# Altium project STM32 MCU.PrjPcb
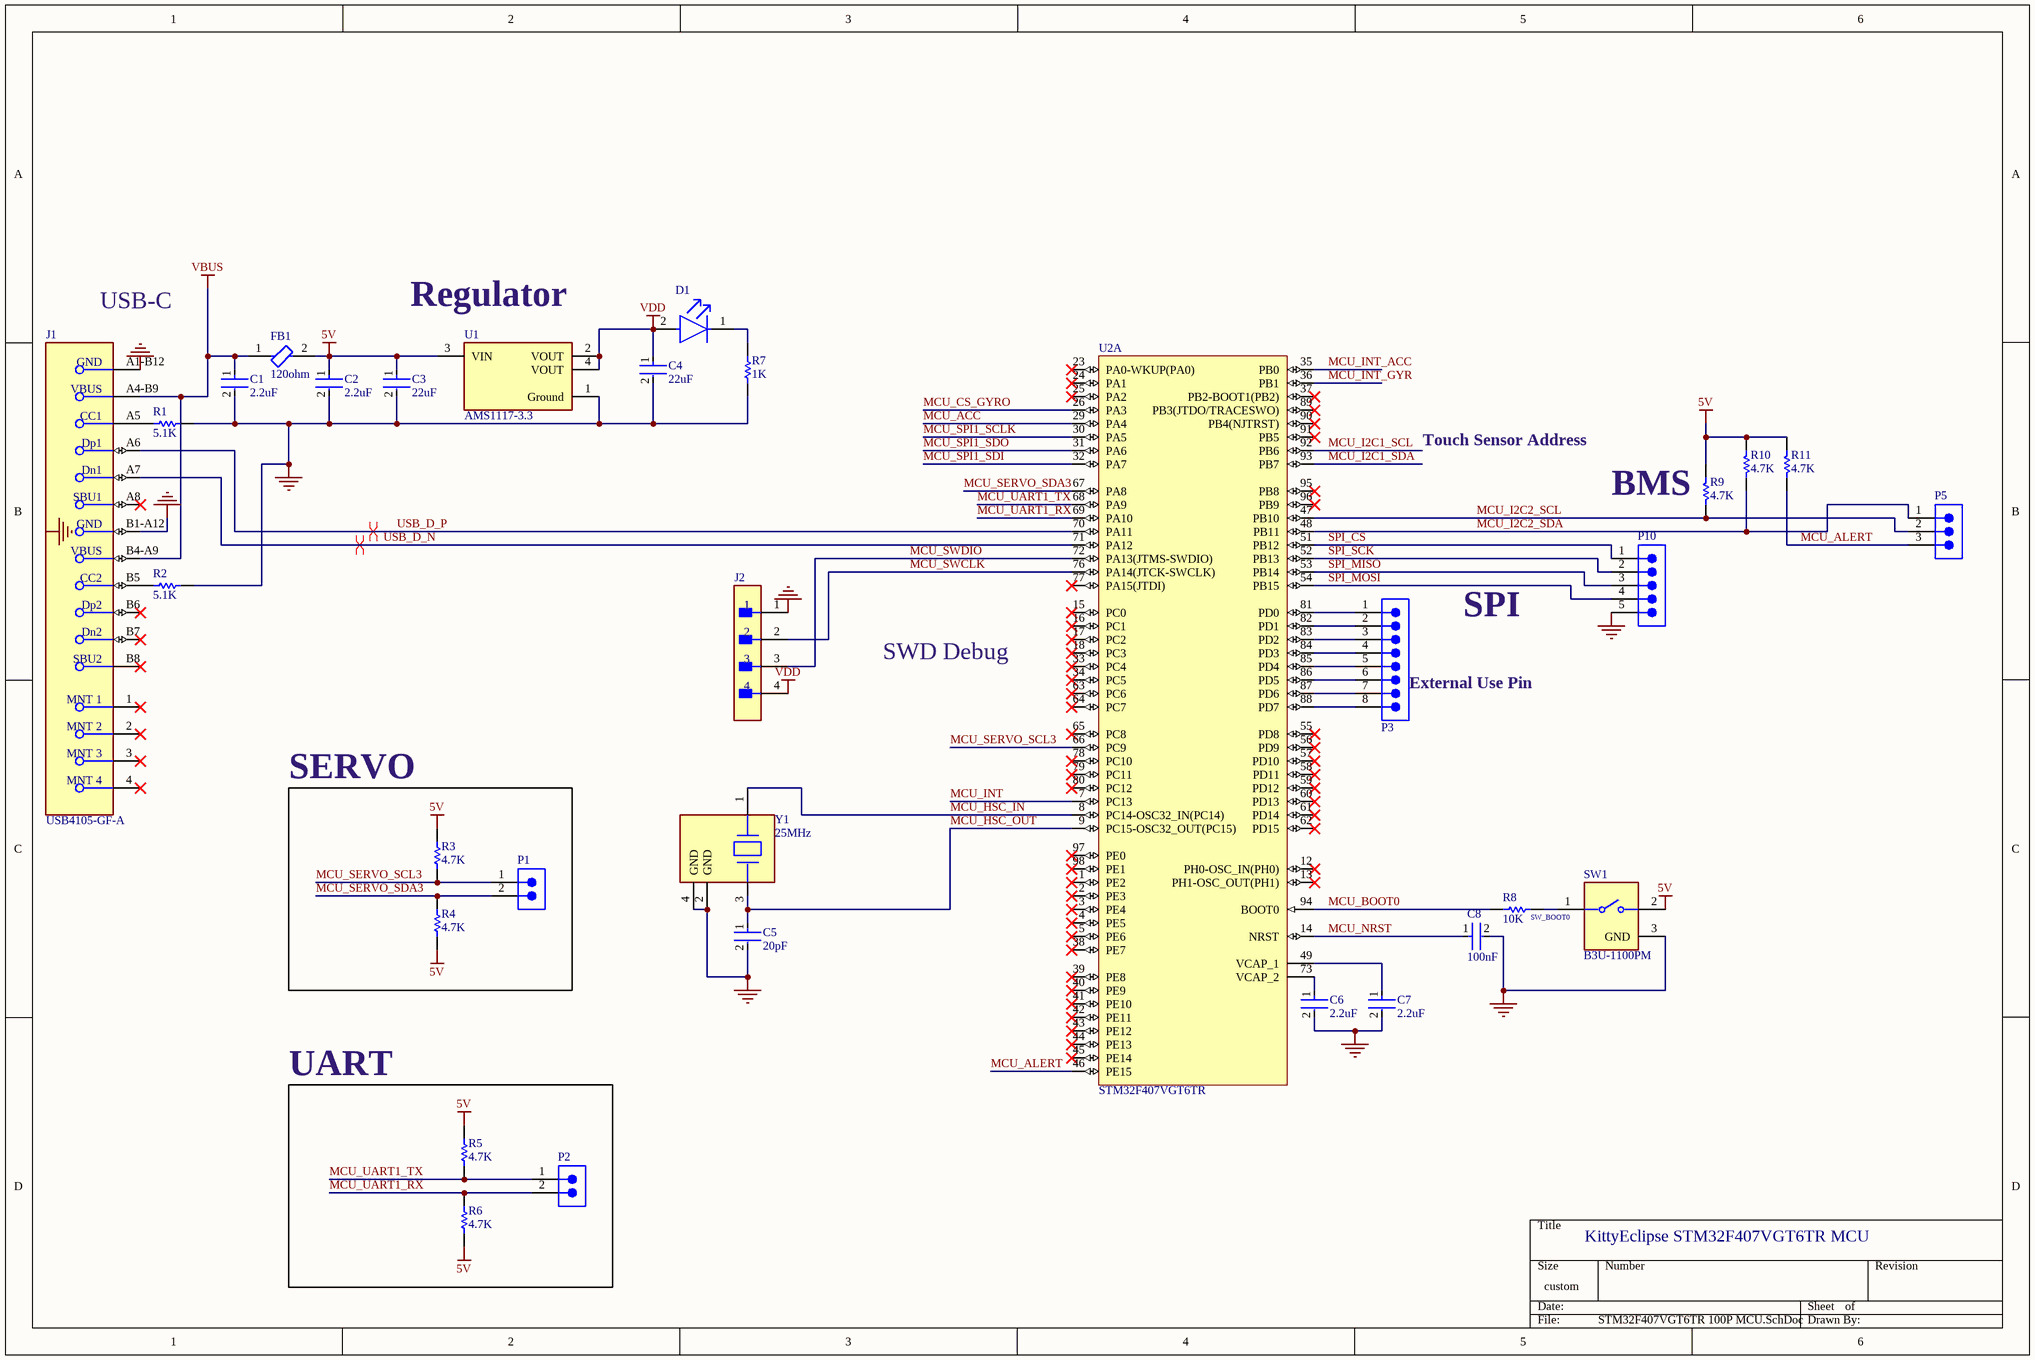
[diagram p0: STM32F407VGT6TR 100P MCU.SchDoc]
2 sheets, 52 parts. Net scope: global (net labels, ports and power ports of the same name join across sheets).
Board file: MCU.PcbDoc
Sheets:
  STM32F407VGT6TR 100P MCU.SchDoc
  Power.SchDoc

## Sheet STM32F407VGT6TR 100P MCU.SchDoc
size 381 x 254 mm

### Parts
C1  2.2uF  [FP-CL10-IPC_A]
C2  2.2uF  [FP-CL10-IPC_A]
C3  22uF  [FP-CL21-IPC_A]
C4  22uF  [FP-CL21-IPC_A]
C5  20pF  [FP-GCM155-0_05-IPC_A]
C6  2.2uF  [FP-CL10-IPC_A]
C7  2.2uF  [FP-CL10-IPC_A]
C8  100nF  [FP-CL93-IPC_C]
D1  LTST-C190GKT  [FP-LTST-C190GKT-MFG]  (value not drawn)
FB1  120ohm  [FP-MPZ1608-0_8-IPC_C]
J1  USB4105-GF-A  [FP-USB4105-GF-A-MFG]
J2  B4B-ZR(LF)(SN)  [FP-B4B-ZR_LF_SN-MFG]  (value not drawn)
P1  61300211121  [61300211121]  (value not drawn)
P2  61300211121  [61300211121]  (value not drawn)
P3  61300811121  [61300811121]  (value not drawn)
P5  61300311121  [61300311121]  (value not drawn)
P10  61300511121  [61300511121]  (value not drawn)
R1  5.1K  [RESC1005X40X25NL10T10]
R2  5.1K  [RESC1005X40X25NL10T10]
R3  4.7K  [RESC1608X55X25LL10T15]
R4  4.7K  [RESC1608X55X25LL10T15]
R5  4.7K  [RESC1608X55X25LL10T15]
R6  4.7K  [RESC1608X55X25LL10T15]
R7  1K  [RESC1608X55X30LL15T15]
R8  10K  [RESC1608X55X25ML10T15]
R9  4.7K  [RESC1608X55X25LL10T15]
R10  4.7K  [RESC1608X55X25LL10T15]
R11  4.7K  [RESC1608X55X25LL10T15]
SW1  B3U-1100PM  [FP-B3U-1100PM-MFG]
U1  AMS1117-3.3  [FP-AMS1117-IPC_C]
U2  STM32F407VGT6TR  [STM-LQFP100_L]  (part A of 2)
Y1  25MHz  [FP-ABM11W-MFG]

### Blocks framed on the sheet
SERVO: P1 R3 R4
UART: P2 R5 R6

### Nets
5V: C2.1 C3.1 FB1.2 R3.2 R4.1 R5.1 R6.1 R9.1 R10.1 R11.1 SW1.2 U1.3(VIN)
GND: C1.2 C2.2 C3.2 C4.2 C5.2 C6.2 C7.2 C8.2 J1.A1-B12(GND) J1.B1-A12(GND) J2.1 P10.5 R1.2 R2.2 R7.2 SW1.3(GND) U1.1(Ground) Y1.2(GND) Y1.4(GND)
VBUS: C1.1 FB1.1 J1.A4-B9(VBUS) J1.B4-A9(VBUS)
VDD: C4.1 D1.2(A) J2.4 U1.2(VOUT) U1.4(VOUT)
MCU_ACC: U2.29(PA4)
MCU_ALERT: P5.3 R11.2 U2.46(PE15)
MCU_BOOT0: R8.1 U2.94(BOOT0)
MCU_CS_GYRO: U2.26(PA3)
MCU_HSC_IN: U2.8(PC14-OSC32_IN(PC14)) Y1.1
MCU_HSC_OUT: C5.1 U2.9(PC15-OSC32_OUT(PC15)) Y1.3
MCU_I2C1_SCL: U2.92(PB6)
MCU_I2C1_SDA: U2.93(PB7)
MCU_I2C2_SCL: P5.2 R9.2 U2.47(PB10)
MCU_I2C2_SDA: P5.1 R10.2 U2.48(PB11)
MCU_INT: U2.7(PC13)
MCU_INT_ACC: U2.35(PB0)
MCU_INT_GYR: U2.36(PB1)
MCU_NRST: C8.1 U2.14(NRST)
MCU_SERVO_SCL3: P1.1 R3.1 U2.66(PC9)
MCU_SERVO_SDA3: P1.2 R4.2 U2.67(PA8)
MCU_SPI1_SCLK: U2.30(PA5)
MCU_SPI1_SDI: U2.32(PA7)
MCU_SPI1_SDO: U2.31(PA6)
MCU_SWCLK: J2.2 U2.76(PA14(JTCK-SWCLK))
MCU_SWDIO: J2.3 U2.72(PA13(JTMS-SWDIO))
MCU_UART1_RX: P2.2 R6.2 U2.69(PA10)
MCU_UART1_TX: P2.1 R5.2 U2.68(PA9)
SPI_CS: P10.1 U2.51(PB12)
SPI_MISO: P10.3 U2.53(PB14)
SPI_MOSI: P10.4 U2.54(PB15)
SPI_SCK: P10.2 U2.52(PB13)
USB_D_N: J1.A7(Dn1) U2.71(PA12)
USB_D_P: J1.A6(Dp1) U2.70(PA11)
NetC6_1: C6.1 U2.73(VCAP_2)
NetC7_1: C7.1 U2.49(VCAP_1)
NetD1_1: D1.1(C) R7.1
NetJ1_A5: J1.A5(CC1) R1.1
NetJ1_B5: J1.B5(CC2) R2.1
NetP3_1: P3.1 U2.81(PD0)
NetP3_2: P3.2 U2.82(PD1)
NetP3_3: P3.3 U2.83(PD2)
NetP3_4: P3.4 U2.84(PD3)
NetP3_5: P3.5 U2.85(PD4)
NetP3_6: P3.6 U2.86(PD5)
NetP3_7: P3.7 U2.87(PD6)
NetP3_8: P3.8 U2.88(PD7)
NetR8_2: R8.2 SW1.1

Not connected (* = marked no-connect by the designer): J1 1(MNT_1)* 2(MNT_2)* 3(MNT_3)* 4(MNT_4)* A8(SBU1)* B6(Dp2)* B7(Dn2)* B8(SBU2)*; U2 1(PE2)* 2(PE3)* 3(PE4)* 4(PE5)* 5(PE6)* 12(PH0-OSC_IN(PH0))* 13(PH1-OSC_OUT(PH1))* 15(PC0)* 16(PC1)* 17(PC2)* 18(PC3)* 23(PA0-WKUP(PA0))* 24(PA1)* 25(PA2)* 33(PC4)* 34(PC5)* 37(PB2-BOOT1(PB2))* 38(PE7)* 39(PE8)* 40(PE9)* 41(PE10)* 42(PE11)* 43(PE12)* 44(PE13)* 45(PE14)* 55(PD8)* 56(PD9)* 57(PD10)* 58(PD11)* 59(PD12)* 60(PD13)* 61(PD14)* 62(PD15)* 63(PC6)* 64(PC7)* 65(PC8)* 77(PA15(JTDI))* 78(PC10)* 79(PC11)* 80(PC12)* 89(PB3(JTDO/TRACESWO))* 90(PB4(NJTRST))* 91(PB5)* 95(PB8)* 96(PB9)* 97(PE0)* 98(PE1)*

### Layout directives
differential pair: USB_D_N, USB_D_P

### Notes on the sheet
- USB-C
- (near U1) Regulator
- Touch Sensor Address
- BMS
- SPI
- SWD Debug
- (near P3) External Use Pin
- (near R8) SW_BOOT0
- KittyEclipse STM32F407VGT6TR MCU
- Labels drawn without touching a wire or pin: GND

### Library data of the parts
C1 C2 C6 C7 = CMP-13271-000835-1: Cap Ceramic 2.2uF 16V X5R ±10% Pad SMD 0603 +85°C T/R; Case Code (Metric): 1608; Height: 0.8mm; Case/Package: 0603; Depth: 0.8mm; Capacitance: 2.2uF; Voltage Rating: 16V; Case Code (Imperial): 0603; Length: 1.6mm; Packaging: Tape and Reel; Material: Ceramic; Lead Free: Lead Free; Max Operating Temperature: 85°C; Contact Plating: Tin; Thickness: 0.035inch; Radiation Hardening: No; Tolerance: 10%; Min Operating Temperature: -55°C; Voltage: 16V; Dielectric: X5R; Mount: Surface Mount; Package Quantity: 4000; Width: 0.031inch; Voltage Rating (DC): 16V
C3 C4 = CMP-13271-000185-1: CL21 Series 0805 22uF 6.3V ±20% Tolerance X5R Multilayer Ceramic Chip Capacitor; Height: 1.25mm; Length: 2mm; Capacitance: 22uF; Mount: Surface Mount; Dielectric: X5R; Voltage Rating (DC): 6.3V; Case Code (Metric): 2012; Depth: 1.25mm; Max Operating Temperature: 85°C; Voltage Rating: 6.3V; Width: 0.049inch; Case/Package: 0805; Radiation Hardening: No; Thickness: 0.055inch; Packaging: Tape and Reel; Package Quantity: 2000; Lead Free: Lead Free; Contact Plating: Tin; Min Operating Temperature: -55°C; Case Code (Imperial): 0805; Tolerance: 20%
C5 = CMP-2008-03702-3: Ceramic Capacitor for Automotive 220pF ±5% 50VDC C0G 0402 Paper T/R; Temperature Coefficient: 30ppm/°C; Voltage Rating (DC): 50V; Thickness: 0.022inch; REACH SVHC: No SVHC; Termination: SMD/SMT; Radiation Hardening: No; Max Operating Temperature: 125°C; Mount: Surface Mount; Package Quantity: 1; Dielectric: C0G; Height: 0.5mm; Case Code (Imperial): 0402; Lead Free: Lead Free; Voltage Rating: 50V; Capacitance: 220pF; Case Code (Metric): 1005; Min Operating Temperature: -55°C; Case/Package: 0402; Packaging: Tape and Reel; Voltage: 50V; Ratings: AEC-Q200; Depth: 0.5mm; Length: 1mm; Tolerance: 5%; Width: 0.02inch
C8 = CMP-13271-000610-1: Cap Ceramic 100nF 10V X7R ±10% SMD 0402 +125°C Paper T/R
D1 = CMP-22017-000005-2: LED GREEN CLEAR CHIP SMD; Dominant Wavelength: 569nm; Reverse Voltage: 5V; Lens Color: Colorless; Viewing Angle: 130°; Voltage: 2V; Forward Current: 30mA; Power Dissipation: 100mW; Luminous Intensity: 6mcd; Number of LEDs: 1; Forward Voltage: 2.1V; Wavelength: 565nm; Test Current: 10mA; Min Operating Temperature: -55°C; Lens Style: Clear; Mount: Surface Mount; Width: 0.8mm; Packaging: Tape and Reel; Lens Transparency: Clear; Case Code (Metric): 1608; Depth: 0.8mm; Case Code (Imperial): 0603; Case/Package: 0603; Number of Pins: 2; Max Operating Temperature: 85°C; Lead Free: Lead Free; Number of Elements: 1; Length: 1.6mm; Height: 0.8mm; Package Quantity: 1; Power Rating: 100mW; Radiation Hardening: No; Illumination Color: Green; Color: Green
FB1 = CMP-08257-000448-1: Power line Ferrite Bead 390Ω @ 100MHz 1.2A DCR 0.12Ω SMD 0603; Tolerance: 25%; DC Resistance (DCR): 120mR; Impedance: 390R; Current Rating: 1.2A; RoHS Compliant: Yes; Lead Free: Lead Free; Number of Pins: 2; Case/Package: 0603; Mount: Surface Mount; Packaging: Tape and Reel; Case Code (Imperial): 0603; Core Material: Ferrite; Width: 0.031inch; Length: 0.063inch; Package Quantity: 4000; Height: 0.037inch; Case Code (Metric): 1608; Max DC Current: 1.2A; REACH SVHC: No SVHC; Series: MPZ
J1 = CMP-245163-000001-1: CONN RCPT USB2.0 TYPEC 5A; Manufacturer: GCT; Description: USB - C (Type - C) USB 2.0 Receptacle Connector 24 Position Surface Mount, Right Angle; Through Hole; Voltage Rating: 20V; Is Female: yes; Current Rating: 5/6.25/1.25/0.25A; Number Of Contacts: 16; Conn Orientation: Right Angle; Device Class L1: Connectors; Category: Conn; Lead Free: Yes; RoHS: TRUE; Temperature Range High: +85°C; Digikey Description: CONN RCPT USB2.0 TYPEC 5A; Device Class L3: unset; ComponentLink2Description: Datasheet; Manufacturer Part Number: USB4105-GF-A; Package: 0; Usb Standard: USB 2.0; Device Class L2: USB Connectors; Automotive: No; Temperature Range Low: -40°C; Height: 3.46mm; Temperature: -40°C to +85°C; Contact Material: Gold,Nickel; ComponentLink2URL: https://gct.co/files/drawings/usb4105.pdf; Octopart: https://octopart.com/usb4105-gf-a-gct-106627878
J2 = CMP-17439-000033-1: CONN HEADER VERT 4POS 1.5MM; Max Current Rating: 1A; Max Voltage Rating (AC): 50V; Contact Resistance: 30mR; Body Plating: Tin; Number of Positions: 4; Connector Type: Male Pin; Panel Thickness: 3.5mm; Gender: Male; Insulation Resistance: 500MR; Termination: Solder; Fastening Type: Detent; Housing Material: Polyamide; Voltage Rating (DC): 50V; REACH SVHC: No SVHC; Lead Free: Lead Free; Min Operating Temperature: -25°C; Depth: 3.5mm; Contact Mating Length: 0.094inch; Material: Nylon; Max Operating Temperature: 85°C; Mount: Through Hole; Number of Rows: 1; Orientation: Straight; Current Rating: 1A; Flammability Rating: UL94 V-0; Housing Color: Beige; Length: 7.5mm; Packaging: Bulk; Voltage Rating: 50V; Voltage Rating (AC): 50V; Number of Contacts: 4; Lead Pitch: 1.5mm; Series: ZH; Color: Natural; Contact Plating: Tin; Pitch: 1.5mm; Contact Type: Male Pin; Contact Material: Brass
P1 P2 = CMP-1712-00002-6: NexarPartId: 20081794; Number of Contacts: 2; Pitch: 2.54mm; Connector Type: Male Pin; Voltage Rating: 250V; Current Rating: 3A; Gender: Male; Contact Resistance: 20mΩ; Height: 8.94mm; Lead Free: Lead Free; Number of Pins: 2; Termination: Through Hole; RoHS: Compliant; Lead Pitch: 2.54mm; REACH SVHC: No SVHC; Housing Material: PBT; Contact Mating Length: 5.9944mm; Min Operating Temperature: -40°C; Orientation: Vertical; Contact Material: Copper; Contact Gender: Male; Max Operating Temperature: 125°C; Number of Rows: 1; Number of Positions: 2; Packaging: Bulk; Contact Plating: Gold; Mount: Through Hole; Color: Black; Operating Supply Voltage: 250V
P3 = CMP-1502-01076-3: NexarPartId: 32855533; Connector Type: Male Pin; Number of Contacts: 8; Voltage Rating: 250V; Current Rating: 3A; Contact Resistance: 20mΩ; Pitch: 2.54mm; Gender: Male; Termination: Solder; Contact Material: Copper; Mount: Through Hole; Lead Pitch: 2.54mm; Number of Positions: 8; Operating Supply Voltage: 250V; Number of Pins: 8; Max Operating Temperature: 105°C; Height: 8.54mm; REACH SVHC: Unknown; Number of Rows: 1; Packaging: Bulk; Contact Plating: Gold; Contact Mating Length: 5.9944mm; Orientation: Vertical; RoHS: Compliant; Color: Black; Min Operating Temperature: -40°C
P5 = CMP-1502-01062-3: NexarPartId: 32855521; Current Rating: 3A; Voltage Rating: 250V; Number of Positions: 3; Pitch: 2.54mm; Contact Resistance: 20mΩ; Connector Type: Male Pin; Gender: Male; REACH SVHC: Unknown; Packaging: Bulk; Contact Material: Copper; Min Operating Temperature: -40°C; Number of Rows: 1; Orientation: Vertical; RoHS: Compliant; Contact Plating: Gold; Max Operating Temperature: 105°C; Mount: Through Hole; Height: 8.94mm; Operating Supply Voltage: 250V; Number of Pins: 3; Contact Mating Length: 5.9944mm; Number of Contacts: 3; Color: Black; Lead Free: Lead Free; Lead Pitch: 2.54mm; Termination: Solder
P10 = CMP-1502-01068-3: NexarPartId: 32855526; Connector Type: Male Pin; Gender: Male; Contact Resistance: 20mΩ; Pitch: 2.54mm; Operating Supply Voltage: 250V; Current Rating: 3A; Number of Contacts: 5; Lead Free: Lead Free; Color: Black; Packaging: Bulk; Lead Pitch: 2.54mm; Contact Material: Copper; Min Operating Temperature: -40°C; Contact Mating Length: 5.9944mm; Voltage Rating: 250V; Number of Pins: 5; Number of Positions: 5; Height: 8.89mm; Orientation: Vertical; REACH SVHC: Unknown; RoHS: Compliant; Contact Plating: Gold; Max Operating Temperature: 105°C; Mount: Through Hole; Number of Rows: 1; Termination: Solder
R1 R2 = CMP-2002-05812-1: Manufacturer: Panasonic; Part Number: ERA-2AEB512X
R3-R6 R9-R11 = CMP-2000-06942-1: Chip Resistor, 4.7 KOhm, +/- 1%, 0.1 W, -55 to 155 degC, 0603 (1608 Metric), RoHS, Tape and Reel; Manufacturer: Yageo; Power Rating: 100mW; Temperature Coefficient: 100PPM/C; Resistance: 4.7kOhms; Voltage Rating: 50V; Package Reference: 0603; Series: RC; Datasheet Version: Rev. 7, 05/2017; Packaging: Reel; Termination Style: SMD/SMT; Datasheet URL: http://www.yageo.com/documents/recent/PYu-RC_Group_51_RoHS_L_7.pdf; Manufacturer URL: http://www.yageo.com/; Package Description: 2-Pin Surface Mount Device, Body 1.6 x 0.8 mm; Case Code - mm: 1608; Case Code - in: 0603; Mounting Technology: SurfaceMount; Operating Temperature Range: -55Cto+155C; Tolerance: 1%; Product: ThickFilmResistorsGeneralPurpose
R7 = CMP-2000-00180-1: Part Number: ERJ-3EKF1001V; Manufacturer: Panasonic
R8 = CMP-2000-05022-1: Resistor, 10 KOhm, +/- 5%, 100 mW, -55 to 155 degC, 0603 (1608 Metric), RoHS, Tape and Reel; Manufacturer: Yageo; Resistance: 10kOhms; Voltage Rating: 50V; Temperature Coefficient: 100PPM/C; Power Rating: 100mW; Package Reference: 603; Series: RC; Case Code - mm: 1608; Packaging: Reel; Datasheet URL: http://www.farnell.com/datasheets/443971.pdf; Datasheet Version: Rev. 4, 04/2009; Operating Temperature Range: -55Cto+155C; Product: ThickFilmResistorsGeneralPurpose; Package Description: 2-Pin Surface Mount Device, Body 1.6 x 0.8 mm; Manufacturer URL: http://www.yageo.com/; Case Code - in: 0603; Tolerance: 5%; Termination Style: SMD/SMT
SW1 = CMP-08834-000028-1: SWITCH TACTILE SPST-NO 0.05A 12V; Switch Travel: 0.15mm; Throw Configuration: SPST; Current Rating: 50mA; Illumination Type: Non-Illuminated; Actuator Length: 0.4mm; Operating Force: 1.5N; Connector Type: SMD/SMT; Contact Resistance: 100mR; Actuator Type: Standard; Electrical Life: 200000Cycles; Switch Function: Off-Mom; Ratings: Dust Proof; Max Operating Temperature: 70°C; Weight: 0.022g; Series: B3U; Min Operating Temperature: -25°C; Voltage Rating (DC): 12V; Orientation: Straight; Package Quantity: 1000; Packaging: Tape and Reel; RoHS Compliant: Yes; REACH SVHC: No SVHC; Max Voltage Rating (DC): 12V; Mount: Surface Mount; Case/Package: SMD/SMT; Mechanical Life: 200000Cycles; Termination: SMD/SMT
U1 = CMP-209535-000001-1: LDO Voltage Regulators 1A, 3.3V; Manufacturer: Advanced Monolithic Systems; Dropout Voltage: 1.1V; Output Type: Fixed; Nominal Supply Current: 5mA; Max Power Dissipation: 1.2W; Max Supply Voltage: 15V; Number Of Outputs: 1; Standoff Height: 0.64mm; Max Junction Temp: +125°C; Height: 1.8mm; Package: AMS1117; Device Class L2: Power Management ICs; ComponentLink2Description: Datasheet; ComponentLink2URL: http://www.advanced-monolithic.com/pdf/ds1117.pdf; Category: IC; RoHS: TRUE; Automotive: No; Device Class L1: Integrated Circuits (ICs); Output Current: 1A; Device Class L3: Voltage Regulators - Linear; Temperature: -40°C to +125°C; Output Voltage: 3.3V; Manufacturer Part Number: AMS1117-3.3; Temperature Range Low: -40°C; Octopart: https://octopart.com/ams1117-3.3-advanced+monolithic+systems-25899300; Lead Free: Yes; Ipc Land Pattern Name: SOT229P700X180-4; Temperature Range High: +125°C
U2 = CMP-0243-00033-2: ARM Cortex-M4 32-bit MCU+FPU, 210 DMIPS, 1024 kB Flash, 192 kB Internal RAM, 82 I/Os, 100-pin LQFP, -40 to 85 degC, Tape and Reel; Manufacturer: STMicroelectronics; Supply Voltage(Vcc) max (V): 3.6; Supply Voltage(Vcc) min (V): 1.8; D/A Converter: 2x12-bit; I/Os (High Current): 82; Operating Frequency(F) (Processor speed) (MHz): 168; FLASH Size (Prog) (kB): 1024; Internal RAM Size (kB): 192; ComponentLink1Description: Manufacturer URL; PackageDescription: 100-Pin Low Profile Quad Flat Package, 14 x 14 mm Body, 0.5 mm Pitch; DatasheetVersion: Rev. 4; ComponentLink1URL: http://www.st.com/web/en/home.html; Mounting Technology: Surface Mount; ComponentLink3URL: http://www.st.com/st-web-ui/static/active/en/resource/technical/document/data_brief/DM00071938.pdf; PartNumber: STM32F407VGT6TR; ComponentLink2URL: http://www.st.com/st-web-ui/static/active/en/resource/technical/document/datasheet/DM00037051.pdf; Packing: Tape and Reel; ComponentLink2Description: Datasheet; PackageReference: LQFP100; ComponentLink3Description: Package Specification; PackageVersion: Rev. 1, 06/2013; Core: ARM Cortex-M4
Y1 = CMP-27762-002822-1: Crystal 25MHz ±10ppm 8pF SMD-4 2mm x 1.6mm

## Sheet Power.SchDoc
size 279 x 248 mm
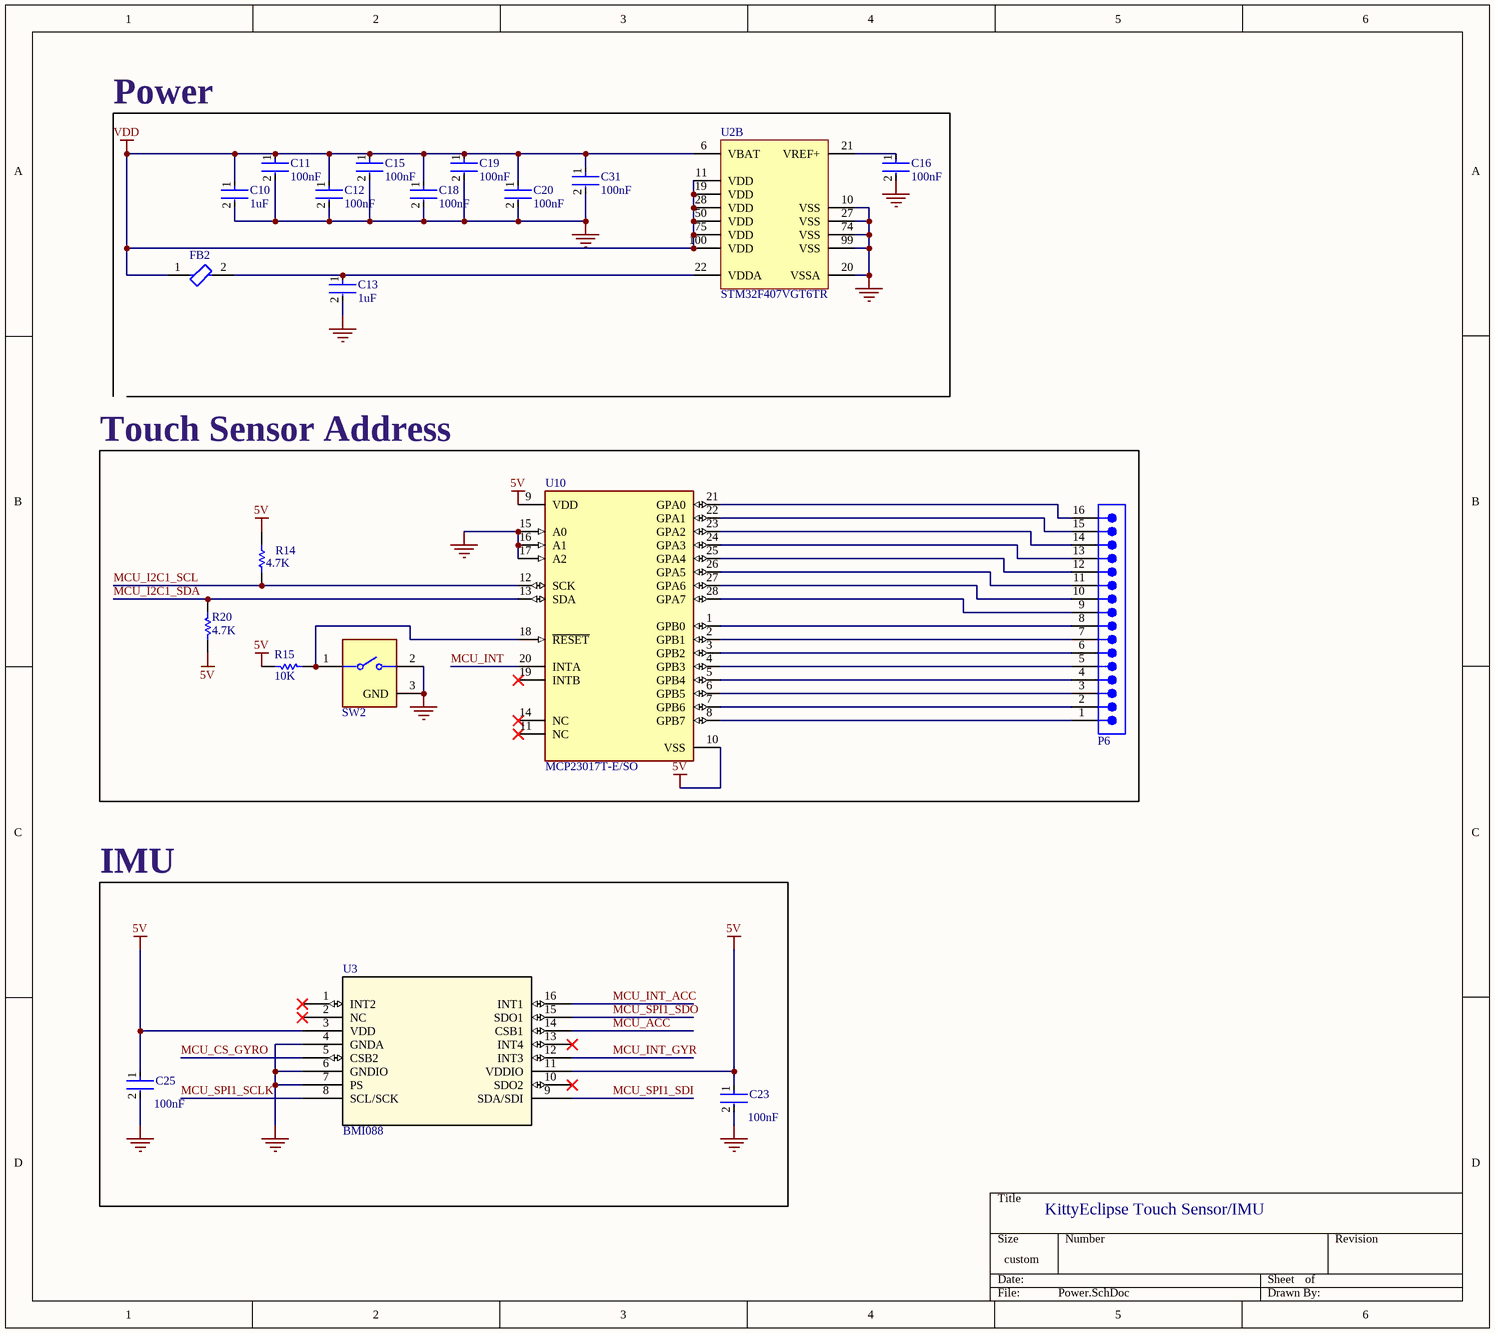
[diagram p1: Power.SchDoc]

### Parts
C10  1uF  [FP-CL10-IPC_C]
C11  100nF  [FP-CL93-IPC_C]
C12  100nF  [FP-CL93-IPC_C]
C13  1uF  [FP-CL10-IPC_C]
C15  100nF  [FP-CL93-IPC_C]
C16  100nF  [FP-CL93-IPC_C]
C18  100nF  [FP-CL93-IPC_C]
C19  100nF  [FP-CL93-IPC_C]
C20  100nF  [FP-CL93-IPC_C]
C23  100nF  [FP-CL93-IPC_C]
C25  100nF  [FP-CL93-IPC_C]
C31  100nF  [FP-CL93-IPC_C]
FB2  600ohm  [FP-BLM15-0_05-MFG]  (value not drawn)
P6  61301611121  [61301611121]  (value not drawn)
R14  4.7K  [RESC1608X55X25LL10T15]
R15  10K  [RESC1608X55X25ML10T15]
R20  4.7K  [RESC1608X55X25LL10T15]
SW2  B3U-1100PM  [FP-B3U-1100PM-MFG]  (value not drawn)
U2  STM32F407VGT6TR  [STM-LQFP100_L]  (part B of 2)
U3  BMI088  [QFN_BMI085_BOS]
U10  MCP23017T-E/SO  [FP-C04-052-MFG]

### Blocks framed on the sheet
Touch Sensor Address: P6 R14 R15 R20 SW2 U10
IMU: C23 C25 U3

### Nets
5V: C23.1 C25.1 R14.1 R15.1 R20.1 U3.3(VDD) U3.11(VDDIO) U10.9(VDD) U10.10(VSS)
GND: C10.2 C11.2 C12.2 C13.2 C15.2 C16.2 C18.2 C19.2 C20.2 C23.2 C25.2 C31.2 SW2.2 SW2.3(GND) U2.10(VSS) U2.20(VSSA) U2.27(VSS) U2.74(VSS) U2.99(VSS) U3.4(GNDA) U3.6(GNDIO) U3.7(PS) U10.15(A0) U10.16(A1) U10.17(A2)
VDD: C10.1 C11.1 C12.1 C15.1 C18.1 C19.1 C20.1 C31.1 FB2.1 U2.6(VBAT) U2.11(VDD) U2.19(VDD) U2.28(VDD) U2.50(VDD) U2.75(VDD) U2.100(VDD)
MCU_ACC: U3.14(CSB1)
MCU_CS_GYRO: U3.5(CSB2)
MCU_I2C1_SCL: R14.2 U10.12(SCK)
MCU_I2C1_SDA: R20.2 U10.13(SDA)
MCU_INT: U10.20(INTA)
MCU_INT_ACC: U3.16(INT1)
MCU_INT_GYR: U3.12(INT3)
MCU_SPI1_SCLK: U3.8(SCL/SCK)
MCU_SPI1_SDI: U3.9(SDA/SDI)
MCU_SPI1_SDO: U3.15(SDO1)
NetC13_1: C13.1 FB2.2 U2.22(VDDA)
NetC16_1: C16.1 U2.21(VREF+)
NetP6_1: P6.1 U10.8(GPB7)
NetP6_2: P6.2 U10.7(GPB6)
NetP6_3: P6.3 U10.6(GPB5)
NetP6_4: P6.4 U10.5(GPB4)
NetP6_5: P6.5 U10.4(GPB3)
NetP6_6: P6.6 U10.3(GPB2)
NetP6_7: P6.7 U10.2(GPB1)
NetP6_8: P6.8 U10.1(GPB0)
NetP6_9: P6.9 U10.28(GPA7)
NetP6_10: P6.10 U10.27(GPA6)
NetP6_11: P6.11 U10.26(GPA5)
NetP6_12: P6.12 U10.25(GPA4)
NetP6_13: P6.13 U10.24(GPA3)
NetP6_14: P6.14 U10.23(GPA2)
NetP6_15: P6.15 U10.22(GPA1)
NetP6_16: P6.16 U10.21(GPA0)
NetR15_2: R15.2 SW2.1 U10.18(~{RESET})

Not connected (* = marked no-connect by the designer): U3 1(INT2)* 2(NC)* 10(SDO2)* 13(INT4)*; U10 11(NC)* 14(NC)* 19(INTB)*

### Notes on the sheet
- Power
- KittyEclipse Touch Sensor/IMU

### Library data of the parts
C10 C13 = CMP-2000-06094-2: Cap Ceramic 1uF 10V X7R ±10% Pad SMD 0603 +125°C T/R; Packaging: Tape and Reel; Depth: 0.8mm; Voltage Rating: 10V; Lead Free: Lead Free; Radiation Hardening: No; Capacitance: 1uF; Length: 1.6mm; Package Quantity: 1; Mount: Surface Mount; Case/Package: 0603; Max Operating Temperature: 125°C; Case Code (Metric): 1608; Height: 0.8mm; Min Operating Temperature: -55°C; Dielectric: X7R; Contact Plating: Tin; Case Code (Imperial): 0603; Thickness: 0.035inch; Voltage Rating (DC): 10V; Tolerance: 10%; Width: 0.031inch
C11 C12 C15 C16 C18-C20 C23 C25 C31 = CMP-13271-000610-1: as C8 on sheet STM32F407VGT6TR 100P MCU
FB2 = CMP-0686-00187-4: Chip Ferrite Bead, 0402, 600Ω @ 100MHz, 0.52Ω, 25%, 300mA; DC Resistance-Max: 600mR; Number of Lines: 1; DC Resistance (DCR): 520mR; Shielding: Unshielded; Impedance: 600R; Material: Steel; Frequency: 100MHz; Lead Free: Lead Free; Max DC Current: 300mA; Test Frequency: 100MHz; Depth: 0.55mm; Length: 1mm; Case Code (Imperial): 0402; Packaging: Tape and Reel; Height: 0.5mm; Max Operating Temperature: 125°C; Military Standard: Not; REACH SVHC: No SVHC; Case Code (Metric): 1005; Series: BLM15AG_SN; Core Material: Ferrite; Termination: SMD/SMT; DC Current: 300mA; Package Quantity: 10000; Width: 0.5mm; RoHS Compliant: Yes; Min Operating Temperature: -55°C; Current Rating: 300mA; Case/Package: 0402; Number of Pins: 2; Radiation Hardening: No; Tolerance: 25%; Number of Circuits: 1; Max Current Rating: 300mA
P6 = CMP-1502-01095-4: NexarPartId: 32855548; Voltage Rating: 250V; Connector Type: Male Pin; Current Rating: 3A; Contact Resistance: 20mΩ; Number of Contacts: 16; Gender: Male; Pitch: 2.54mm; Min Operating Temperature: -40°C; Termination: Solder; Height: 8.89mm; Contact Plating: Gold; Packaging: Bulk; Contact Material: Copper; Mount: Through Hole; Number of Rows: 1; Contact Mating Length: 5.9944mm; Operating Supply Voltage: 250V; RoHS: Compliant; Max Operating Temperature: 105°C; Lead Pitch: 2.54mm; Color: Black; Number of Pins: 16; Number of Positions: 16; REACH SVHC: Unknown; Orientation: Vertical
R14 R20 = CMP-2000-06942-1: as R3 on sheet STM32F407VGT6TR 100P MCU; Package Reference: 0603; Series: RC; Datasheet Version: Rev. 7, 05/2017; Packaging: Reel; Termination Style: SMD/SMT; Datasheet URL: http://www.yageo.com/documents/recent/PYu-RC_Group_51_RoHS_L_7.pdf; Manufacturer URL: http://www.yageo.com/; Package Description: 2-Pin Surface Mount Device, Body 1.6 x 0.8 mm; Case Code - mm: 1608; Case Code - in: 0603; Mounting Technology: SurfaceMount; Operating Temperature Range: -55Cto+155C; Tolerance: 1%; Product: ThickFilmResistorsGeneralPurpose
R15 = CMP-2000-05022-1: as R8 on sheet STM32F407VGT6TR 100P MCU; Package Reference: 603; Series: RC; Case Code - mm: 1608; Packaging: Reel; Datasheet URL: http://www.farnell.com/datasheets/443971.pdf; Datasheet Version: Rev. 4, 04/2009; Operating Temperature Range: -55Cto+155C; Product: ThickFilmResistorsGeneralPurpose; Package Description: 2-Pin Surface Mount Device, Body 1.6 x 0.8 mm; Manufacturer URL: http://www.yageo.com/; Case Code - in: 0603; Tolerance: 5%; Termination Style: SMD/SMT
SW2 = CMP-08834-000028-1: as SW1 on sheet STM32F407VGT6TR 100P MCU; Max Operating Temperature: 70°C; Weight: 0.022g; Series: B3U; Min Operating Temperature: -25°C; Voltage Rating (DC): 12V; Orientation: Straight; Package Quantity: 1000; Packaging: Tape and Reel; RoHS Compliant: Yes; REACH SVHC: No SVHC; Max Voltage Rating (DC): 12V; Mount: Surface Mount; Case/Package: SMD/SMT; Mechanical Life: 200000Cycles; Termination: SMD/SMT
U2 = CMP-0243-00033-2: as U2 on sheet STM32F407VGT6TR 100P MCU; ComponentLink1Description: Manufacturer URL; PackageDescription: 100-Pin Low Profile Quad Flat Package, 14 x 14 mm Body, 0.5 mm Pitch; DatasheetVersion: Rev. 4; ComponentLink1URL: http://www.st.com/web/en/home.html; Mounting Technology: Surface Mount; ComponentLink3URL: http://www.st.com/st-web-ui/static/active/en/resource/technical/document/data_brief/DM00071938.pdf; PartNumber: STM32F407VGT6TR; ComponentLink2URL: http://www.st.com/st-web-ui/static/active/en/resource/technical/document/datasheet/DM00037051.pdf; Packing: Tape and Reel; ComponentLink2Description: Datasheet; PackageReference: LQFP100; ComponentLink3Description: Package Specification; PackageVersion: Rev. 1, 06/2013; Core: ARM Cortex-M4
U3 = BMI088: No Description Available; Mfr_Name: Bosch Sensortec; RefDes: RefDes; Type: Type
U10 = CMP-0186-00060-3: IC I/O EXPANDER I2C 16B 28SOIC; Number of Channels: 1; Operating Supply Voltage: 5.5V; Max Frequency: 1.7MHz; Nominal Supply Current: 1mA; Number of Bits: 16; Interface: I2C; Number of Pins: 28; Max Operating Temperature: 125°C; Packaging: Tape and Reel; Case/Package: SOIC; Package Quantity: 1600; Min Operating Temperature: -40°C; Lead Free: Lead Free; Frequency: 1.7MHz; Number of I/Os: 16

## Nets that join several sheets
5V: STM32F407VGT6TR 100P MCU (12 pins), Power (9 pins)
GND: STM32F407VGT6TR 100P MCU (19 pins), Power (25 pins)
VDD: STM32F407VGT6TR 100P MCU (5 pins), Power (16 pins)
MCU_ACC: STM32F407VGT6TR 100P MCU (U2.29), Power (U3.14)
MCU_CS_GYRO: STM32F407VGT6TR 100P MCU (U2.26), Power (U3.5)
MCU_I2C1_SCL: STM32F407VGT6TR 100P MCU (U2.92), Power (R14.2 U10.12)
MCU_I2C1_SDA: STM32F407VGT6TR 100P MCU (U2.93), Power (R20.2 U10.13)
MCU_INT: STM32F407VGT6TR 100P MCU (U2.7), Power (U10.20)
MCU_INT_ACC: STM32F407VGT6TR 100P MCU (U2.35), Power (U3.16)
MCU_INT_GYR: STM32F407VGT6TR 100P MCU (U2.36), Power (U3.12)
MCU_SPI1_SCLK: STM32F407VGT6TR 100P MCU (U2.30), Power (U3.8)
MCU_SPI1_SDI: STM32F407VGT6TR 100P MCU (U2.32), Power (U3.9)
MCU_SPI1_SDO: STM32F407VGT6TR 100P MCU (U2.31), Power (U3.15)